# Altium schematic sheet LPCB220 - REMOTE ACCELS.SchDoc
size A3; Address1: Factory 10; Address2: 9-13 Dingley Avenue, Dandeong, VICTORIA 3175, AUSTRALIA; DocumentNumber: 14; Revision: 1; SheetNumber: 14; SheetTotal: 18; Lockie__PCB_SUB_ASSEMBLY: Remote Accelerometer System; Lockie__PCB_ASSEMBLY: Brake Control; Lockie__LDL: LPCB220; Lockie__PCB_DESCRIPTION: Redundant Stepper Node
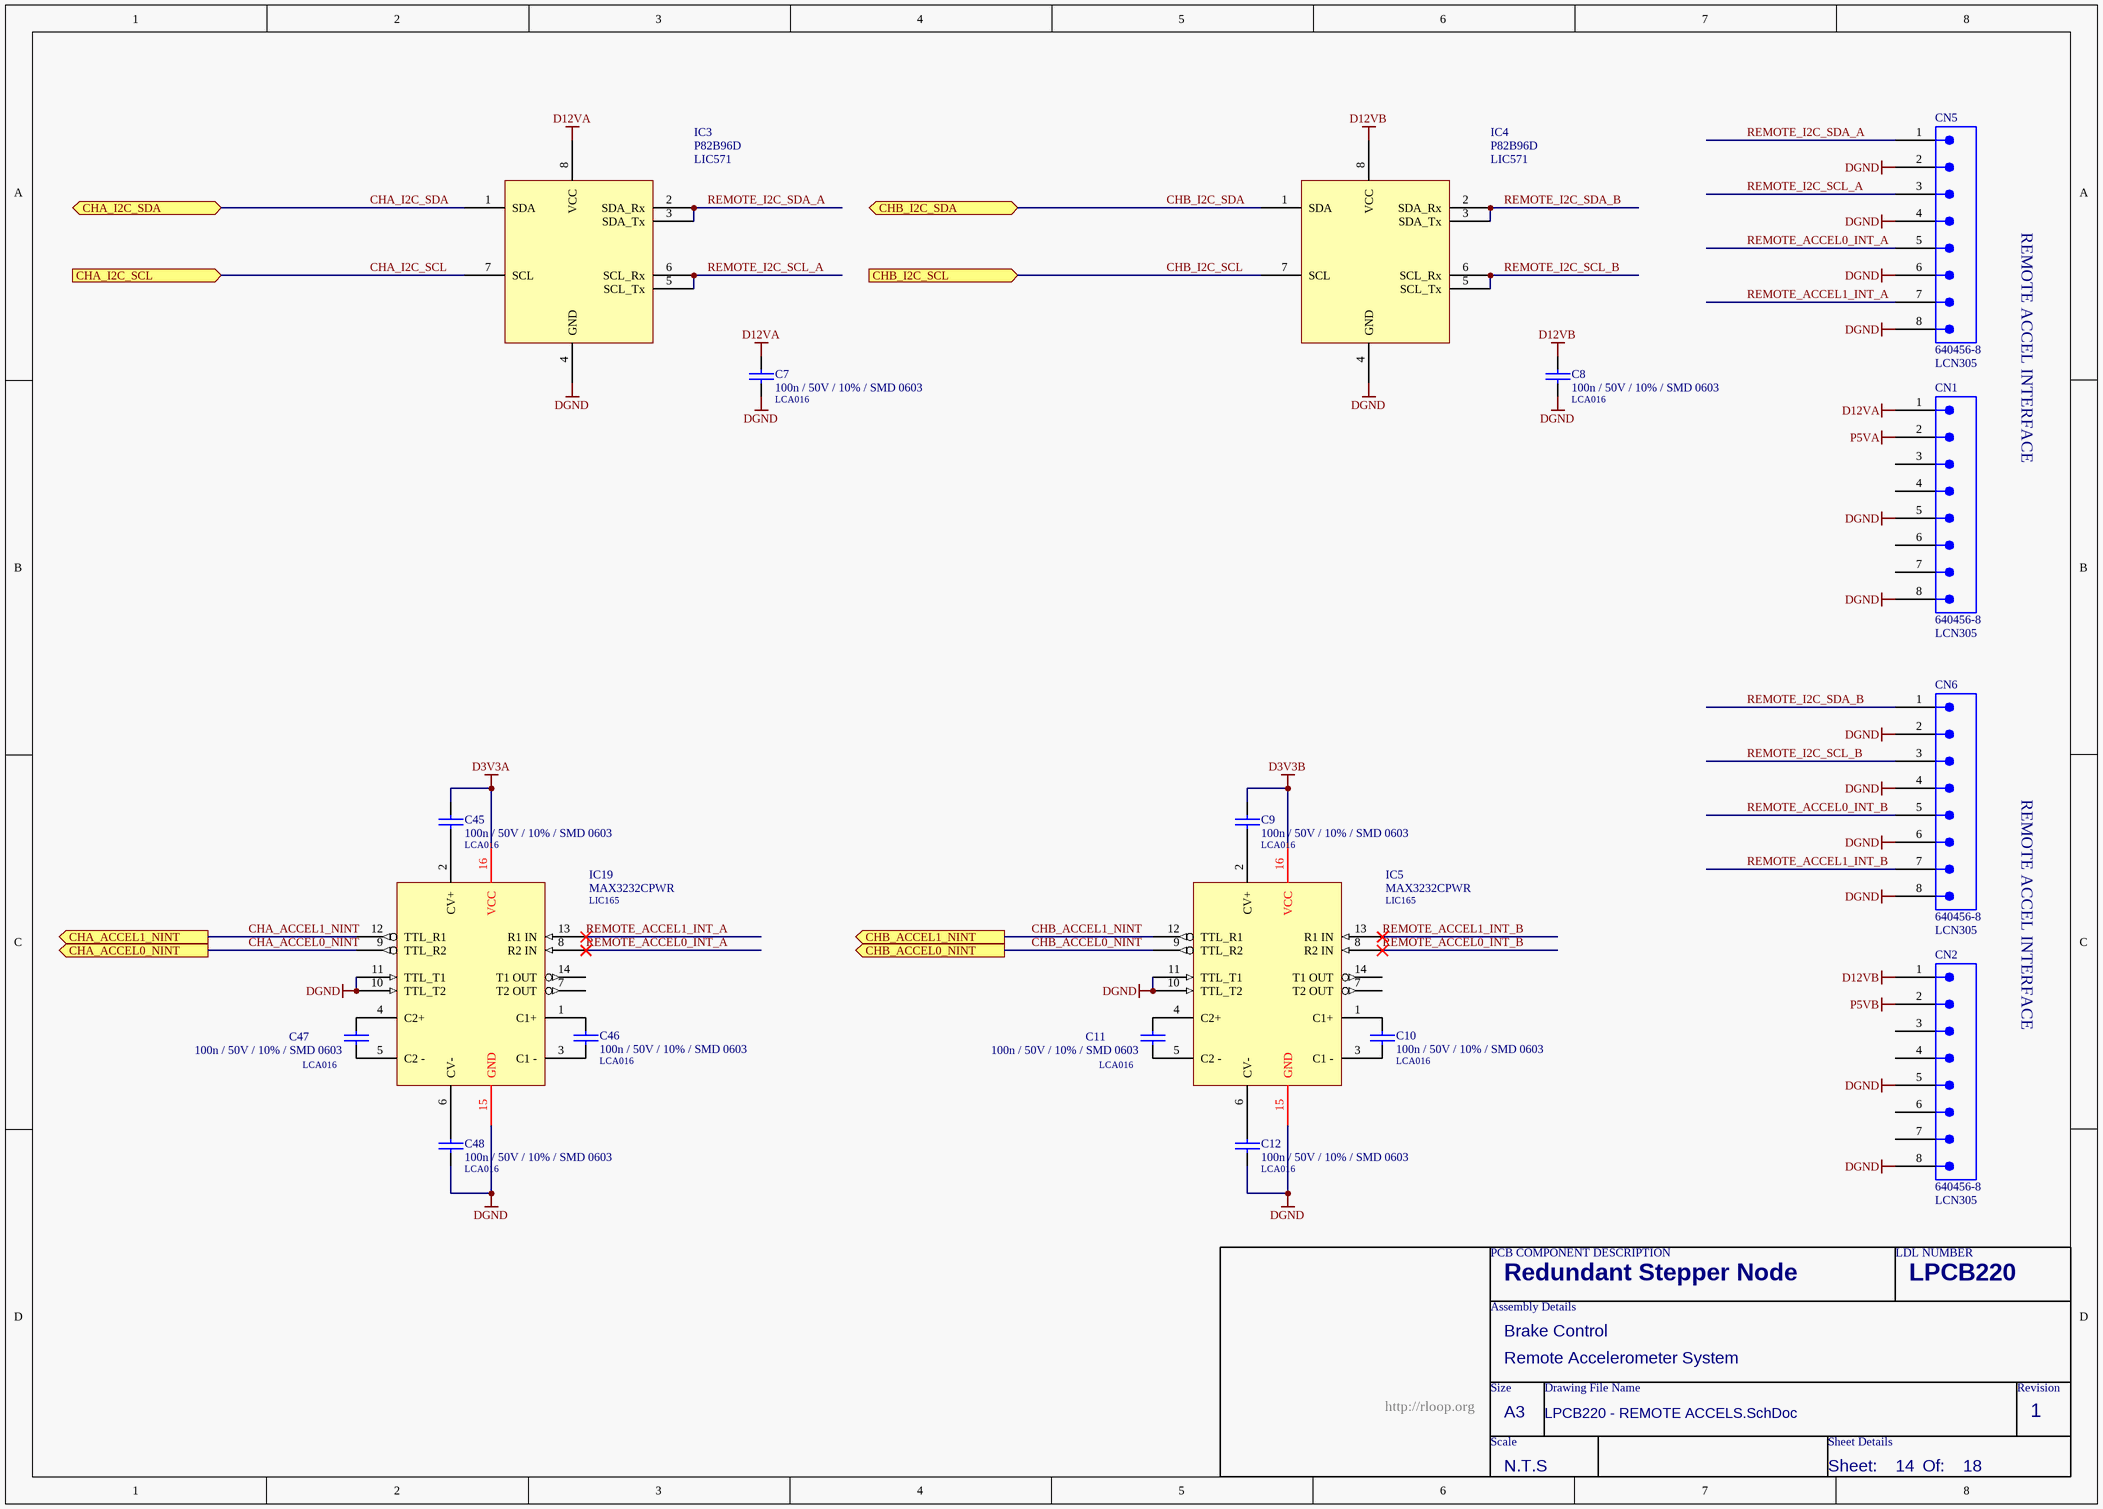
[diagram p0: LPCB220 - REMOTE ACCELS.SchDoc]

## Parts
C7  100n / 50V / 10% / SMD 0603  LDL_NUMBER: LCA016  [LFP011__CC1608-0603-IPC7351_B]
C8  100n / 50V / 10% / SMD 0603  LDL_NUMBER: LCA016  [LFP011__CC1608-0603-IPC7351_B]
C9  100n / 50V / 10% / SMD 0603  LDL_NUMBER: LCA016  [LFP011__CC1608-0603-IPC7351_B]
C10  100n / 50V / 10% / SMD 0603  LDL_NUMBER: LCA016  [LFP011__CC1608-0603-IPC7351_B]
C11  100n / 50V / 10% / SMD 0603  LDL_NUMBER: LCA016  [LFP011__CC1608-0603-IPC7351_B]
C12  100n / 50V / 10% / SMD 0603  LDL_NUMBER: LCA016  [LFP011__CC1608-0603-IPC7351_B]
C45  100n / 50V / 10% / SMD 0603  LDL_NUMBER: LCA016  [LFP011__CC1608-0603-IPC7351_B]
C46  100n / 50V / 10% / SMD 0603  LDL_NUMBER: LCA016  [LFP011__CC1608-0603-IPC7351_B]
C47  100n / 50V / 10% / SMD 0603  LDL_NUMBER: LCA016  [LFP011__CC1608-0603-IPC7351_B]
C48  100n / 50V / 10% / SMD 0603  LDL_NUMBER: LCA016  [LFP011__CC1608-0603-IPC7351_B]
CN1  640456-8  LDL_NUMBER: LCN305  [640456-8]
CN2  640456-8  LDL_NUMBER: LCN305  [640456-8]
CN5  640456-8  LDL_NUMBER: LCN305  [640456-8]
CN6  640456-8  LDL_NUMBER: LCN305  [640456-8]
IC3  P82B96D  LDL_NUMBER: LIC571  [LFP097__SOIC150-8]
IC4  P82B96D  LDL_NUMBER: LIC571  [LFP097__SOIC150-8]
IC5  MAX3232CPWR  LDL_NUMBER: LIC165  [LFP049__TSSOP-16]
IC19  MAX3232CPWR  LDL_NUMBER: LIC165  [LFP049__TSSOP-16]

## Ports
CHA_ACCEL0_NINT (out), CHA_ACCEL1_NINT (out), CHA_I2C_SCL (in), CHA_I2C_SDA (bidir), CHB_ACCEL0_NINT (out), CHB_ACCEL1_NINT (out), CHB_I2C_SCL (in), CHB_I2C_SDA (bidir)

## Nets
D3V3A: C45.1 IC19.16(VCC)
D3V3B: C9.1 IC5.16(VCC)
D12VA: C7.1 CN1.1 IC3.8(VCC)
D12VB: C8.1 CN2.1 IC4.8(VCC)
DGND: C7.2 C8.2 C12.2 C48.2 CN1.5 CN1.8 CN2.5 CN2.8 CN5.2 CN5.4 CN5.6 CN5.8 CN6.2 CN6.4 CN6.6 CN6.8 IC3.4(GND) IC4.4(GND) IC5.10(TTL_T2) IC5.11(TTL_T1) IC5.15(GND) IC19.10(TTL_T2) IC19.11(TTL_T1) IC19.15(GND)
P5VA: CN1.2
P5VB: CN2.2
CHA_ACCEL0_NINT: IC19.9(TTL_R2) ; port CHA_ACCEL0_NINT
CHA_ACCEL1_NINT: IC19.12(TTL_R1) ; port CHA_ACCEL1_NINT
CHA_I2C_SCL: IC3.7(SCL) ; port CHA_I2C_SCL
CHA_I2C_SDA: IC3.1(SDA) ; port CHA_I2C_SDA
CHB_ACCEL0_NINT: IC5.9(TTL_R2) ; port CHB_ACCEL0_NINT
CHB_ACCEL1_NINT: IC5.12(TTL_R1) ; port CHB_ACCEL1_NINT
CHB_I2C_SCL: IC4.7(SCL) ; port CHB_I2C_SCL
CHB_I2C_SDA: IC4.1(SDA) ; port CHB_I2C_SDA
REMOTE_ACCEL0_INT_A: CN5.5 IC19.8(R2_IN)
REMOTE_ACCEL0_INT_B: CN6.5 IC5.8(R2_IN)
REMOTE_ACCEL1_INT_A: CN5.7 IC19.13(R1_IN)
REMOTE_ACCEL1_INT_B: CN6.7 IC5.13(R1_IN)
REMOTE_I2C_SCL_A: CN5.3 IC3.5(SCL_Tx) IC3.6(SCL_Rx)
REMOTE_I2C_SCL_B: CN6.3 IC4.5(SCL_Tx) IC4.6(SCL_Rx)
REMOTE_I2C_SDA_A: CN5.1 IC3.2(SDA_Rx) IC3.3(SDA_Tx)
REMOTE_I2C_SDA_B: CN6.1 IC4.2(SDA_Rx) IC4.3(SDA_Tx)
NetC9_2: C9.2 IC5.2(CV+)
NetC10_1: C10.1 IC5.1(C1+)
NetC10_2: C10.2 IC5.3(C1_-)
NetC11_1: C11.1 IC5.4(C2+)
NetC11_2: C11.2 IC5.5(C2_-)
NetC12_1: C12.1 IC5.6(CV-)
NetC45_2: C45.2 IC19.2(CV+)
NetC46_1: C46.1 IC19.1(C1+)
NetC46_2: C46.2 IC19.3(C1_-)
NetC47_1: C47.1 IC19.4(C2+)
NetC47_2: C47.2 IC19.5(C2_-)
NetC48_1: C48.1 IC19.6(CV-)

Not connected (* = marked no-connect by the designer): CN1 3 4 6 7; CN2 3 4 6 7; IC5 7(T2_OUT) 14(T1_OUT); IC19 7(T2_OUT) 14(T1_OUT)

## Notes on the sheet
- REMOTE ACCEL INTERFACE
- PCB COMPONENT DESCRIPTION
- LDL NUMBER
- Assembly Details
- Size
- Drawing File Name
- Revision
- http://rloop.org
- Scale
- A3
- Sheet Details
- N.T.S
- Sheet:
- Of:

## Library data of the parts
C7 C8 = 100n / 50V / 10% / SMD 0603: Capacitor, Ceramic Chip, 100nF (0.1uF), 50V, 5%, SMD 0603 [LCA016]; FMEDA__OPERATING__VOLTAGE_MIN: 0; FMEDA__OPERATING__VOLTAGE_MAX: 3.3; FMEDA__OPERATING__TEMP_MIN: -20; FMEDA__OPERATING__TEMP_TYP: 27; FMEDA__OPERATING__TEMP_MAX: 50; FMEDA__CHANNEL: COM; Value: 100n; FMEDA__FUNCTION_IN_SYSTEM: *; FMEDA__OPERATING__VOLTAGE_TYP: 3.3
C9-C12 C45-C48 = 100n / 50V / 10% / SMD 0603: Capacitor, Ceramic Chip, 100nF, 50V, 10%, SMD 0603; FMEDA__OPERATING__VOLTAGE_MIN: 0; FMEDA__OPERATING__VOLTAGE_MAX: 3.3; FMEDA__OPERATING__TEMP_MIN: -20; FMEDA__OPERATING__TEMP_TYP: 27; FMEDA__OPERATING__TEMP_MAX: 50; FMEDA__CHANNEL: COM; Value: 100n; FMEDA__FUNCTION_IN_SYSTEM: *; FMEDA__OPERATING__VOLTAGE_TYP: 3.3
CN1 CN2 CN5 CN6 = 640456-8: Connector, Male Header, 8 Way; FMEDA__CHANNEL: COM; FMEDA__OPERATING__CURRENT_MAX: 0; FMEDA__OPERATING__TEMP_MAX: 50; FMEDA__OPERATING__TEMP_MIN: -20; FMEDA__OPERATING__TEMP_TYP: 27; FMEDA__OPERATING__VOLTAGE_MAX: 16; FMEDA__OPERATING__VOLTAGE_TYP: 12; FMEDA__FUNCTION_IN_SYSTEM: *; FMEDA__OPERATING__CURRENT_MIN: 0; FMEDA__OPERATING__CURRENT_TYP: 0; FMEDA__OPERATING__VOLTAGE_MIN: 0
IC3 IC4 = P82B96D: IC, I2C Line Driver [LIC571]
IC5 IC19 = MAX3232CPWR: IC, RS232 Line Driver, 3.3V, SMD TSSOP16; FMEDA__OPERATING__TEMP_MAX: 50; FMEDA__OPERATING__TEMP_MIN: -20; FMEDA__OPERATING__TEMP_TYP: 27; FMEDA__CHANNEL: COM; FMEDA__OPERATING__VOLTAGE_MAX: 3.3; FMEDA__OPERATING__VOLTAGE_MIN: 0; FMEDA__FUNCTION_IN_SYSTEM: *; FMEDA__OPERATING__VOLTAGE_TYP: 3.3